# EAGLE schematic NeoPixel_HD_rev0 (EAGLE 7.2.0)
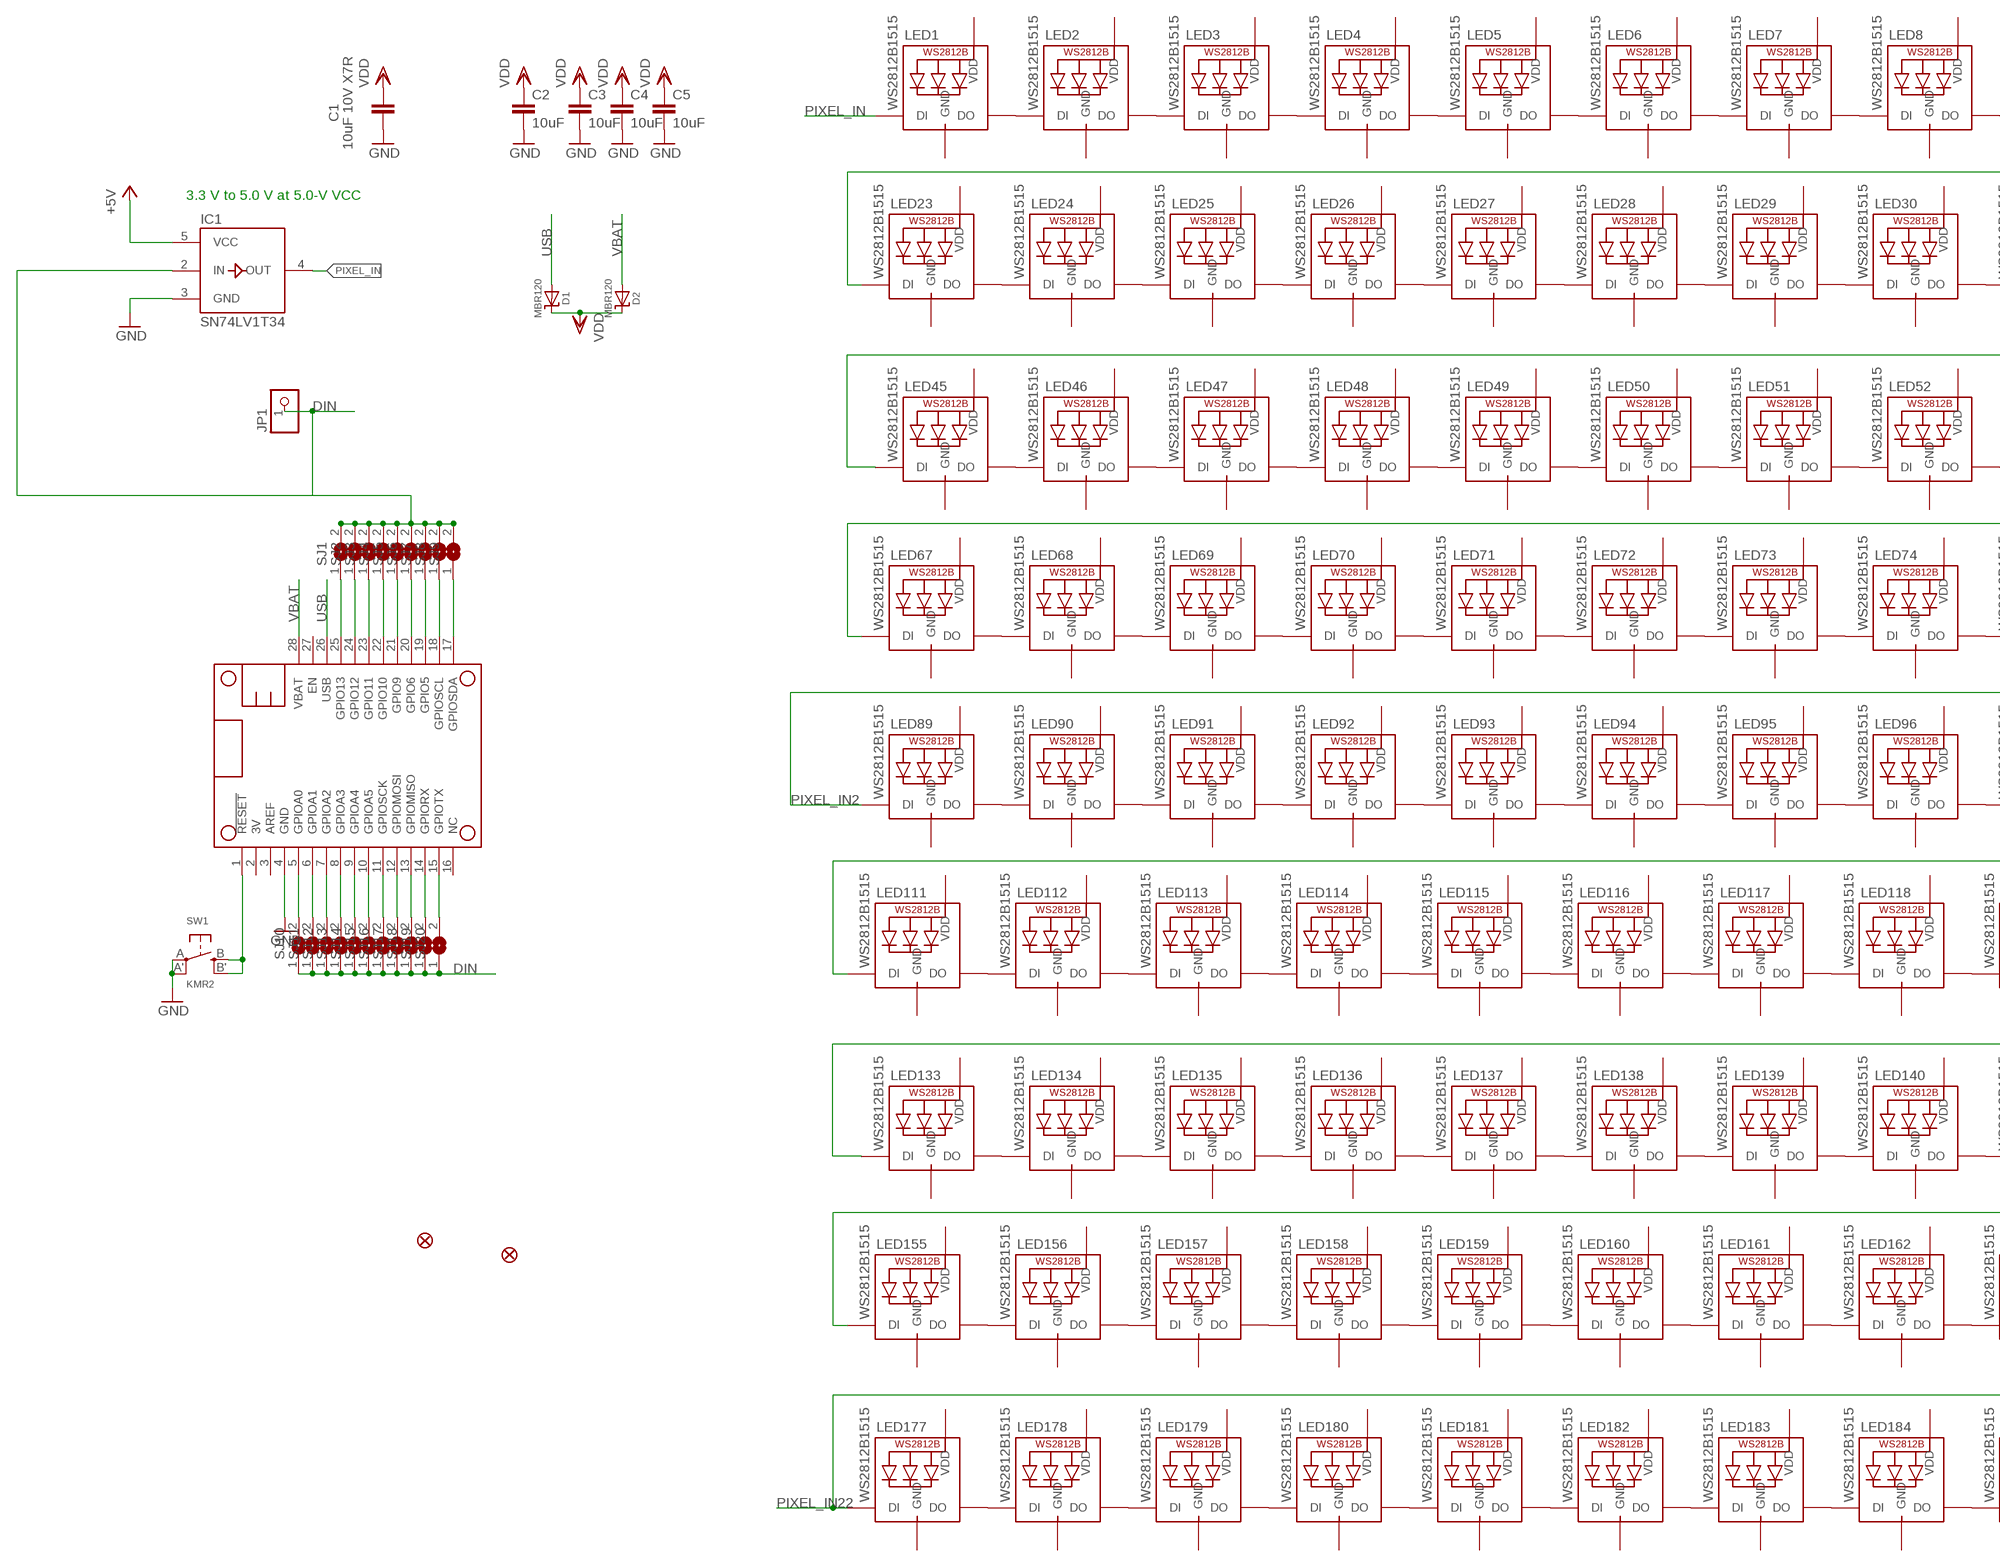
[diagram p0: schematic, sheet 1, part 1 of 2]
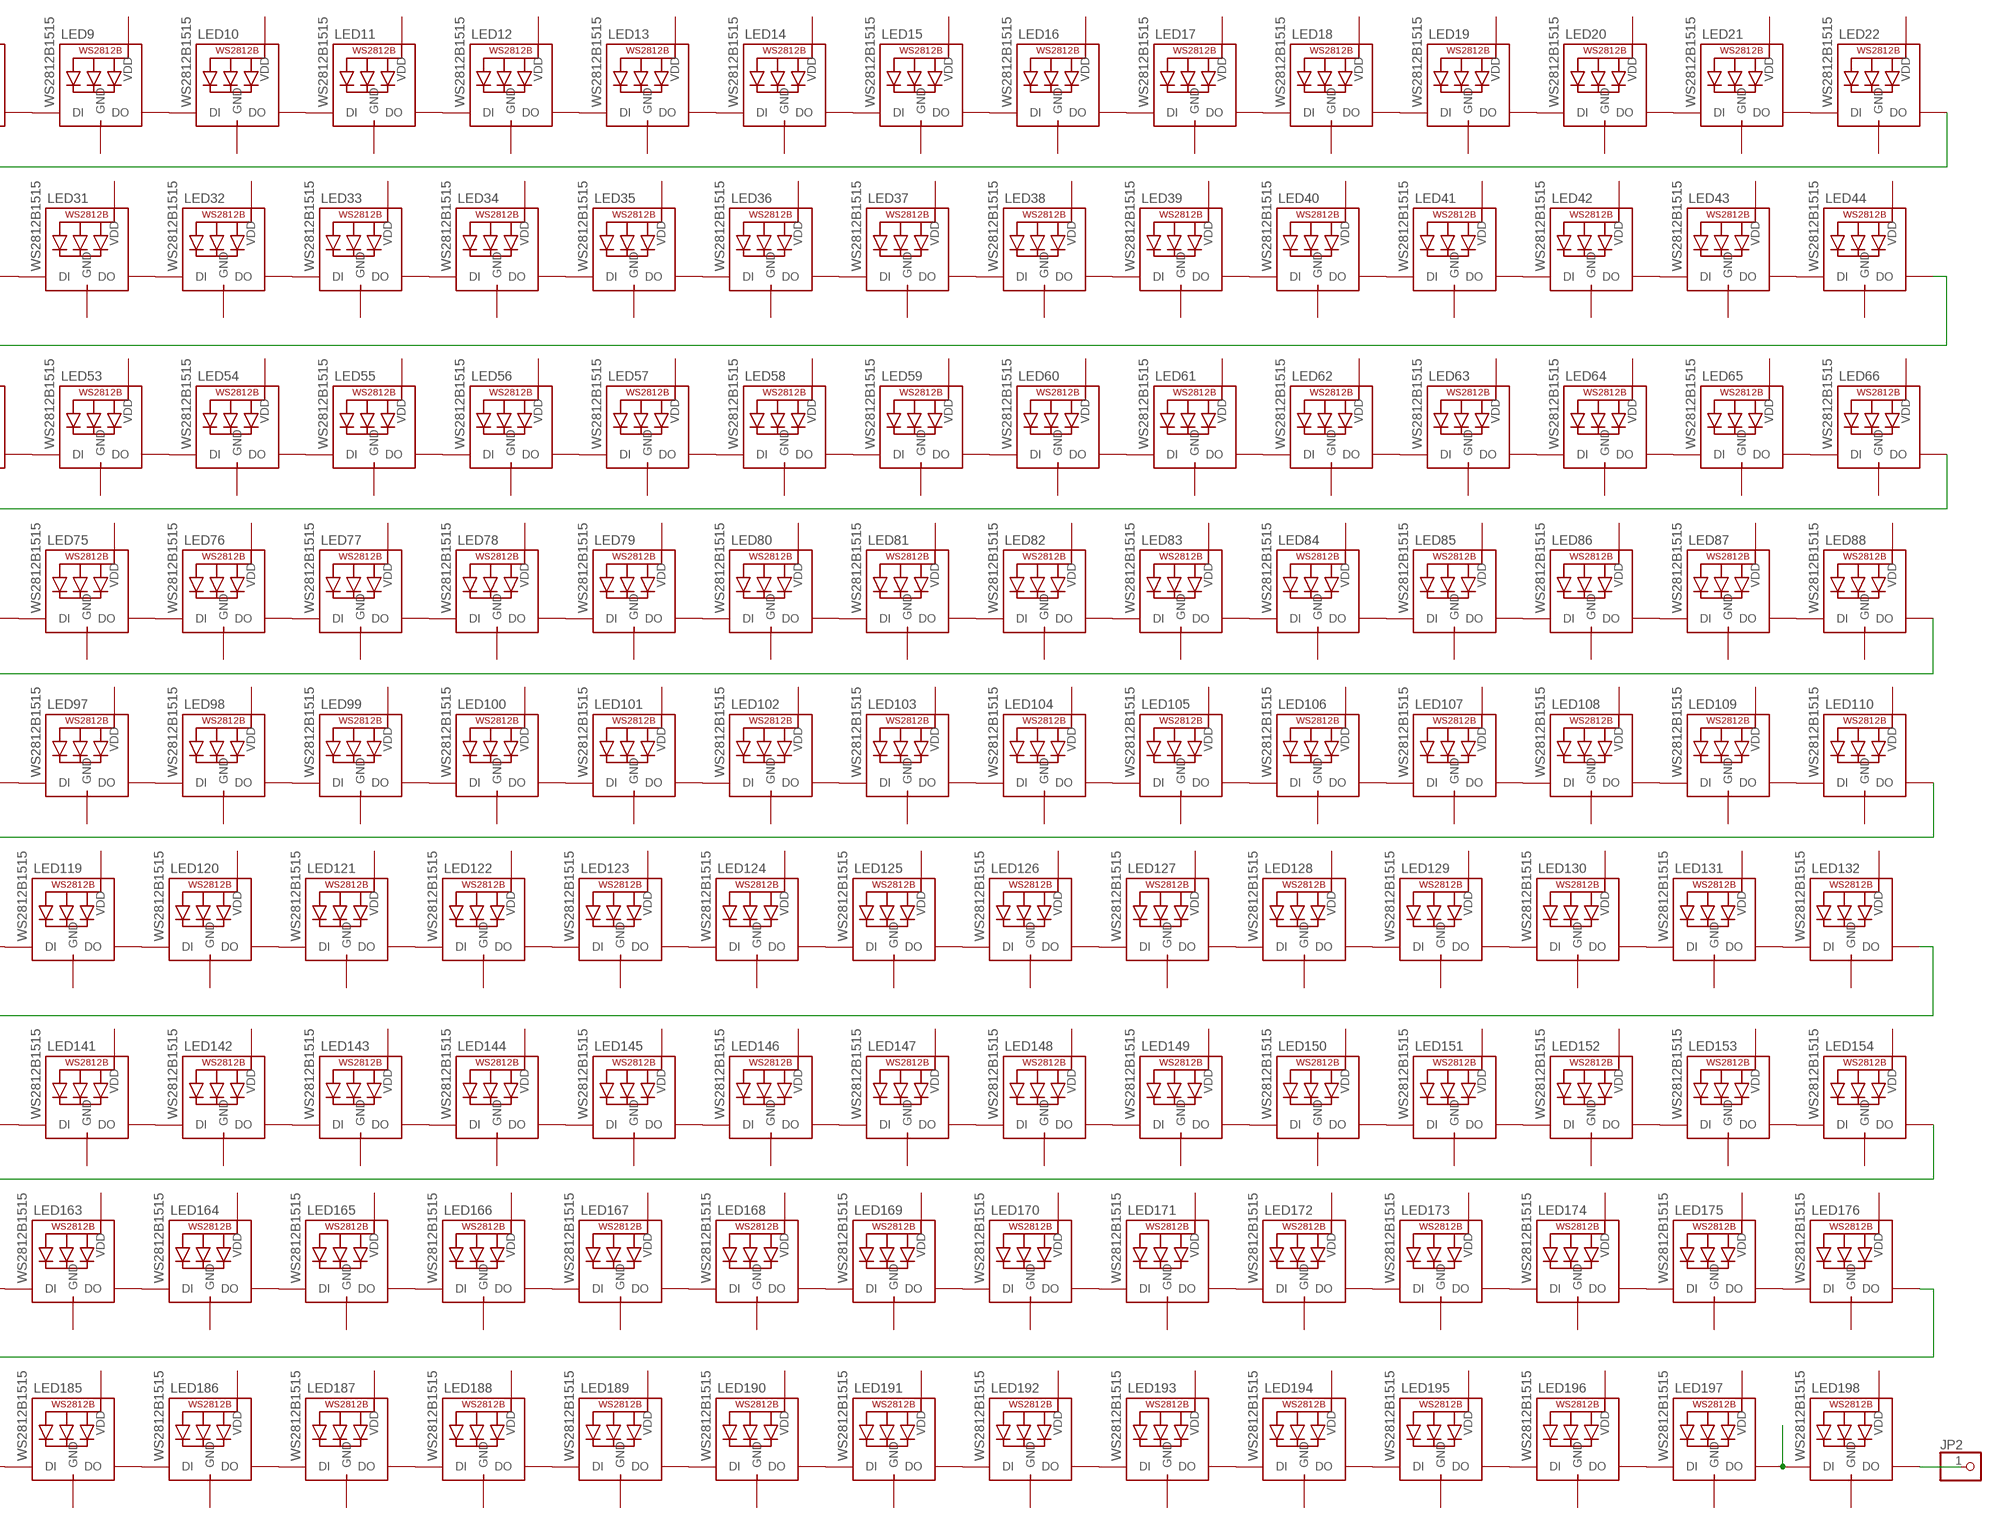
[diagram p1: schematic, sheet 1, part 2 of 2]

## Parts
C1  10uF 10V X7R  C-EUC0603-VISHAY  [C0603-VISHAY]
C2  10uF  C-EUC0603-VISHAY  [C0603-VISHAY]
C3  10uF  C-EUC0603-VISHAY  [C0603-VISHAY]
C4  10uF  C-EUC0603-VISHAY  [C0603-VISHAY]
C5  10uF  C-EUC0603-VISHAY  [C0603-VISHAY]
D1  MBR120  DIODE-SCHOTTKYSOD-123  [SOD-123]
D2  MBR120  DIODE-SCHOTTKYSOD-123  [SOD-123]
FID1  FIDUCIAL""  [FIDUCIAL_1MM]
FID2  FIDUCIAL""  [FIDUCIAL_1MM]
IC1  SN74LV1T34  [DCK_R-PDSO-G5]
JP1  HEADER-1X1ROUND  [1X01_ROUND]
JP2  HEADER-1X1ROUND  [1X01_ROUND]
LED1  WS2812B1515  [LED1515]
LED2  WS2812B1515  [LED1515]
LED3  WS2812B1515  [LED1515]
LED4  WS2812B1515  [LED1515]
LED5  WS2812B1515  [LED1515]
LED6  WS2812B1515  [LED1515]
LED7  WS2812B1515  [LED1515]
LED8  WS2812B1515  [LED1515]
LED9  WS2812B1515  [LED1515]
LED10  WS2812B1515  [LED1515]
LED11  WS2812B1515  [LED1515]
LED12  WS2812B1515  [LED1515]
LED13  WS2812B1515  [LED1515]
LED14  WS2812B1515  [LED1515]
LED15  WS2812B1515  [LED1515]
LED16  WS2812B1515  [LED1515]
LED17  WS2812B1515  [LED1515]
LED18  WS2812B1515  [LED1515]
LED19  WS2812B1515  [LED1515]
LED20  WS2812B1515  [LED1515]
LED21  WS2812B1515  [LED1515]
LED22  WS2812B1515  [LED1515]
LED23  WS2812B1515  [LED1515]
LED24  WS2812B1515  [LED1515]
LED25  WS2812B1515  [LED1515]
LED26  WS2812B1515  [LED1515]
LED27  WS2812B1515  [LED1515]
LED28  WS2812B1515  [LED1515]
LED29  WS2812B1515  [LED1515]
LED30  WS2812B1515  [LED1515]
LED31  WS2812B1515  [LED1515]
LED32  WS2812B1515  [LED1515]
LED33  WS2812B1515  [LED1515]
LED34  WS2812B1515  [LED1515]
LED35  WS2812B1515  [LED1515]
LED36  WS2812B1515  [LED1515]
LED37  WS2812B1515  [LED1515]
LED38  WS2812B1515  [LED1515]
LED39  WS2812B1515  [LED1515]
LED40  WS2812B1515  [LED1515]
LED41  WS2812B1515  [LED1515]
LED42  WS2812B1515  [LED1515]
LED43  WS2812B1515  [LED1515]
LED44  WS2812B1515  [LED1515]
LED45  WS2812B1515  [LED1515]
LED46  WS2812B1515  [LED1515]
LED47  WS2812B1515  [LED1515]
LED48  WS2812B1515  [LED1515]
LED49  WS2812B1515  [LED1515]
LED50  WS2812B1515  [LED1515]
LED51  WS2812B1515  [LED1515]
LED52  WS2812B1515  [LED1515]
LED53  WS2812B1515  [LED1515]
LED54  WS2812B1515  [LED1515]
LED55  WS2812B1515  [LED1515]
LED56  WS2812B1515  [LED1515]
LED57  WS2812B1515  [LED1515]
LED58  WS2812B1515  [LED1515]
LED59  WS2812B1515  [LED1515]
LED60  WS2812B1515  [LED1515]
LED61  WS2812B1515  [LED1515]
LED62  WS2812B1515  [LED1515]
LED63  WS2812B1515  [LED1515]
LED64  WS2812B1515  [LED1515]
LED65  WS2812B1515  [LED1515]
LED66  WS2812B1515  [LED1515]
LED67  WS2812B1515  [LED1515]
LED68  WS2812B1515  [LED1515]
LED69  WS2812B1515  [LED1515]
LED70  WS2812B1515  [LED1515]
LED71  WS2812B1515  [LED1515]
LED72  WS2812B1515  [LED1515]
LED73  WS2812B1515  [LED1515]
LED74  WS2812B1515  [LED1515]
LED75  WS2812B1515  [LED1515]
LED76  WS2812B1515  [LED1515]
LED77  WS2812B1515  [LED1515]
LED78  WS2812B1515  [LED1515]
LED79  WS2812B1515  [LED1515]
LED80  WS2812B1515  [LED1515]
LED81  WS2812B1515  [LED1515]
LED82  WS2812B1515  [LED1515]
LED83  WS2812B1515  [LED1515]
LED84  WS2812B1515  [LED1515]
LED85  WS2812B1515  [LED1515]
LED86  WS2812B1515  [LED1515]
LED87  WS2812B1515  [LED1515]
LED88  WS2812B1515  [LED1515]
LED89  WS2812B1515  [LED1515]
LED90  WS2812B1515  [LED1515]
LED91  WS2812B1515  [LED1515]
LED92  WS2812B1515  [LED1515]
LED93  WS2812B1515  [LED1515]
LED94  WS2812B1515  [LED1515]
LED95  WS2812B1515  [LED1515]
LED96  WS2812B1515  [LED1515]
LED97  WS2812B1515  [LED1515]
LED98  WS2812B1515  [LED1515]
LED99  WS2812B1515  [LED1515]
LED100  WS2812B1515  [LED1515]
LED101  WS2812B1515  [LED1515]
LED102  WS2812B1515  [LED1515]
LED103  WS2812B1515  [LED1515]
LED104  WS2812B1515  [LED1515]
LED105  WS2812B1515  [LED1515]
LED106  WS2812B1515  [LED1515]
LED107  WS2812B1515  [LED1515]
LED108  WS2812B1515  [LED1515]
LED109  WS2812B1515  [LED1515]
LED110  WS2812B1515  [LED1515]
LED111  WS2812B1515  [LED1515]
LED112  WS2812B1515  [LED1515]
LED113  WS2812B1515  [LED1515]
LED114  WS2812B1515  [LED1515]
LED115  WS2812B1515  [LED1515]
LED116  WS2812B1515  [LED1515]
LED117  WS2812B1515  [LED1515]
LED118  WS2812B1515  [LED1515]
LED119  WS2812B1515  [LED1515]
LED120  WS2812B1515  [LED1515]
LED121  WS2812B1515  [LED1515]
LED122  WS2812B1515  [LED1515]
LED123  WS2812B1515  [LED1515]
LED124  WS2812B1515  [LED1515]
LED125  WS2812B1515  [LED1515]
LED126  WS2812B1515  [LED1515]
LED127  WS2812B1515  [LED1515]
LED128  WS2812B1515  [LED1515]
LED129  WS2812B1515  [LED1515]
LED130  WS2812B1515  [LED1515]
LED131  WS2812B1515  [LED1515]
LED132  WS2812B1515  [LED1515]
LED133  WS2812B1515  [LED1515]
LED134  WS2812B1515  [LED1515]
LED135  WS2812B1515  [LED1515]
LED136  WS2812B1515  [LED1515]
LED137  WS2812B1515  [LED1515]
LED138  WS2812B1515  [LED1515]
LED139  WS2812B1515  [LED1515]
LED140  WS2812B1515  [LED1515]
LED141  WS2812B1515  [LED1515]
LED142  WS2812B1515  [LED1515]
LED143  WS2812B1515  [LED1515]
LED144  WS2812B1515  [LED1515]
LED145  WS2812B1515  [LED1515]
LED146  WS2812B1515  [LED1515]
LED147  WS2812B1515  [LED1515]
LED148  WS2812B1515  [LED1515]
LED149  WS2812B1515  [LED1515]
LED150  WS2812B1515  [LED1515]
LED151  WS2812B1515  [LED1515]
LED152  WS2812B1515  [LED1515]
LED153  WS2812B1515  [LED1515]
LED154  WS2812B1515  [LED1515]
LED155  WS2812B1515  [LED1515]
LED156  WS2812B1515  [LED1515]
LED157  WS2812B1515  [LED1515]
LED158  WS2812B1515  [LED1515]
LED159  WS2812B1515  [LED1515]
LED160  WS2812B1515  [LED1515]
LED161  WS2812B1515  [LED1515]
LED162  WS2812B1515  [LED1515]
LED163  WS2812B1515  [LED1515]
LED164  WS2812B1515  [LED1515]
LED165  WS2812B1515  [LED1515]
LED166  WS2812B1515  [LED1515]
LED167  WS2812B1515  [LED1515]
LED168  WS2812B1515  [LED1515]
LED169  WS2812B1515  [LED1515]
LED170  WS2812B1515  [LED1515]
LED171  WS2812B1515  [LED1515]
LED172  WS2812B1515  [LED1515]
LED173  WS2812B1515  [LED1515]
LED174  WS2812B1515  [LED1515]
LED175  WS2812B1515  [LED1515]
LED176  WS2812B1515  [LED1515]
LED177  WS2812B1515  [LED1515]
LED178  WS2812B1515  [LED1515]
LED179  WS2812B1515  [LED1515]
LED180  WS2812B1515  [LED1515]
LED181  WS2812B1515  [LED1515]
LED182  WS2812B1515  [LED1515]
LED183  WS2812B1515  [LED1515]
LED184  WS2812B1515  [LED1515]
LED185  WS2812B1515  [LED1515]
LED186  WS2812B1515  [LED1515]
LED187  WS2812B1515  [LED1515]
LED188  WS2812B1515  [LED1515]
LED189  WS2812B1515  [LED1515]
LED190  WS2812B1515  [LED1515]
LED191  WS2812B1515  [LED1515]
LED192  WS2812B1515  [LED1515]
LED193  WS2812B1515  [LED1515]
LED194  WS2812B1515  [LED1515]
LED195  WS2812B1515  [LED1515]
LED196  WS2812B1515  [LED1515]
LED197  WS2812B1515  [LED1515]
LED198  WS2812B1515  [LED1515]
MS1  FEATHERWING  [FEATHERWING]
SJ1  SOLDERJUMPER  [SOLDERJUMPER_ARROW_NOPASTE]
SJ2  SOLDERJUMPER  [SOLDERJUMPER_ARROW_NOPASTE]
SJ3  SOLDERJUMPER  [SOLDERJUMPER_ARROW_NOPASTE]
SJ4  SOLDERJUMPER  [SOLDERJUMPER_ARROW_NOPASTE]
SJ5  SOLDERJUMPER  [SOLDERJUMPER_ARROW_NOPASTE]
SJ6  SOLDERJUMPERCLOSED  [SOLDERJUMPER_CLOSEDWIRE]
SJ7  SOLDERJUMPER  [SOLDERJUMPER_ARROW_NOPASTE]
SJ8  SOLDERJUMPER  [SOLDERJUMPER_ARROW_NOPASTE]
SJ9  SOLDERJUMPER  [SOLDERJUMPER_ARROW_NOPASTE]
SJ10  SOLDERJUMPER  [SOLDERJUMPER_ARROW_NOPASTE]
SJ11  SOLDERJUMPER  [SOLDERJUMPER_ARROW_NOPASTE]
SJ12  SOLDERJUMPER  [SOLDERJUMPER_ARROW_NOPASTE]
SJ13  SOLDERJUMPER  [SOLDERJUMPER_ARROW_NOPASTE]
SJ14  SOLDERJUMPER  [SOLDERJUMPER_ARROW_NOPASTE]
SJ15  SOLDERJUMPER  [SOLDERJUMPER_ARROW_NOPASTE]
SJ16  SOLDERJUMPER  [SOLDERJUMPER_ARROW_NOPASTE]
SJ17  SOLDERJUMPER  [SOLDERJUMPER_ARROW_NOPASTE]
SJ18  SOLDERJUMPER  [SOLDERJUMPER_ARROW_NOPASTE]
SJ19  SOLDERJUMPER  [SOLDERJUMPER_ARROW_NOPASTE]
SJ20  SOLDERJUMPER  [SOLDERJUMPER_ARROW_NOPASTE]
SW1  KMR2  SWITCH_TACT_SMT4.6X2.8  [BTN_KMR2_4.6X2.8]

## Nets
D6: MS1.20(GPIO6) SJ6.1
DIN: IC1.2(IN) JP1.1 SJ1.2 SJ2.2 SJ3.2 SJ4.2 SJ5.2 SJ6.2 SJ7.2 SJ8.2 SJ9.2 SJ10.1 SJ11.1 SJ12.1 SJ13.1 SJ14.1 SJ15.1 SJ16.1 SJ17.1 SJ18.1 SJ19.1 SJ20.1
GND: C1.2 C2.2 C3.2 C4.2 C5.2 IC1.3(GND) MS1.4(GND) SW1.A'(P1) SW1.A(P)
N$1: LED42.DOUT(DO) LED43.DIN(DI)
N$2: LED43.DOUT(DO) LED44.DIN(DI)
N$3: MS1.25(GPIO13) SJ1.1
N$4: MS1.15(GPIOTX) SJ20.2
N$5: MS1.24(GPIO12) SJ2.1
N$6: MS1.14(GPIORX) SJ19.2
N$7: MS1.13(GPIOMISO) SJ18.2
N$8: MS1.12(GPIOMOSI) SJ17.2
N$9: MS1.11(GPIOSCK) SJ16.2
N$10: MS1.10(GPIOA5) SJ15.2
N$11: MS1.9(GPIOA4) SJ14.2
N$12: MS1.8(GPIOA3) SJ13.2
N$13: MS1.7(GPIOA2) SJ12.2
N$14: MS1.6(GPIOA1) SJ11.2
N$15: MS1.5(GPIOA0) SJ10.2
N$16: LED14.DOUT(DO) LED15.DIN(DI)
N$17: LED45.DOUT(DO) LED46.DIN(DI)
N$18: MS1.1(!RESET) SW1.B'(S1) SW1.B(S)
N$19: MS1.23(GPIO11) SJ3.1
N$20: MS1.22(GPIO10) SJ4.1
N$21: MS1.21(GPIO9) SJ5.1
N$22: JP2.1 LED198.DOUT(DO)
N$23: MS1.19(GPIO5) SJ7.1
N$24: MS1.18(GPIOSCL) SJ8.1
N$25: MS1.17(GPIOSDA) SJ9.1
N$26: LED46.DOUT(DO) LED47.DIN(DI)
N$27: LED47.DOUT(DO) LED48.DIN(DI)
N$28: LED48.DOUT(DO) LED49.DIN(DI)
N$29: LED49.DOUT(DO) LED50.DIN(DI)
N$30: LED50.DOUT(DO) LED51.DIN(DI)
N$31: LED51.DOUT(DO) LED52.DIN(DI)
N$32: LED52.DOUT(DO) LED53.DIN(DI)
N$33: LED54.DOUT(DO) LED55.DIN(DI)
N$34: LED53.DOUT(DO) LED54.DIN(DI)
N$35: LED55.DOUT(DO) LED56.DIN(DI)
N$36: LED56.DOUT(DO) LED57.DIN(DI)
N$37: LED59.DOUT(DO) LED60.DIN(DI)
N$38: LED60.DOUT(DO) LED61.DIN(DI)
N$39: LED61.DOUT(DO) LED62.DIN(DI)
N$40: LED62.DOUT(DO) LED63.DIN(DI)
N$41: LED63.DOUT(DO) LED64.DIN(DI)
N$42: LED64.DOUT(DO) LED65.DIN(DI)
N$43: LED65.DOUT(DO) LED66.DIN(DI)
N$44: LED66.DOUT(DO) LED67.DIN(DI)
N$45: LED68.DOUT(DO) LED69.DIN(DI)
N$46: LED67.DOUT(DO) LED68.DIN(DI)
N$47: LED69.DOUT(DO) LED70.DIN(DI)
N$48: LED70.DOUT(DO) LED71.DIN(DI)
N$49: LED73.DOUT(DO) LED74.DIN(DI)
N$50: LED74.DOUT(DO) LED75.DIN(DI)
N$51: LED75.DOUT(DO) LED76.DIN(DI)
N$52: LED76.DOUT(DO) LED77.DIN(DI)
N$53: LED77.DOUT(DO) LED78.DIN(DI)
N$54: LED1.DOUT(DO) LED2.DIN(DI)
N$55: LED2.DOUT(DO) LED3.DIN(DI)
N$56: LED3.DOUT(DO) LED4.DIN(DI)
N$57: LED4.DOUT(DO) LED5.DIN(DI)
N$58: LED5.DOUT(DO) LED6.DIN(DI)
N$59: LED6.DOUT(DO) LED7.DIN(DI)
N$60: LED7.DOUT(DO) LED8.DIN(DI)
N$61: LED8.DOUT(DO) LED9.DIN(DI)
N$62: LED10.DOUT(DO) LED11.DIN(DI)
N$63: LED9.DOUT(DO) LED10.DIN(DI)
N$64: LED11.DOUT(DO) LED12.DIN(DI)
N$65: LED12.DOUT(DO) LED13.DIN(DI)
N$66: LED15.DOUT(DO) LED16.DIN(DI)
N$67: LED16.DOUT(DO) LED17.DIN(DI)
N$68: LED17.DOUT(DO) LED18.DIN(DI)
N$69: LED18.DOUT(DO) LED19.DIN(DI)
N$71: LED19.DOUT(DO) LED20.DIN(DI)
N$72: LED20.DOUT(DO) LED21.DIN(DI)
N$73: LED21.DOUT(DO) LED22.DIN(DI)
N$74: LED22.DOUT(DO) LED23.DIN(DI)
N$75: LED24.DOUT(DO) LED25.DIN(DI)
N$76: LED23.DOUT(DO) LED24.DIN(DI)
N$77: LED25.DOUT(DO) LED26.DIN(DI)
N$78: LED26.DOUT(DO) LED27.DIN(DI)
N$79: LED29.DOUT(DO) LED30.DIN(DI)
N$80: LED30.DOUT(DO) LED31.DIN(DI)
N$81: LED31.DOUT(DO) LED32.DIN(DI)
N$82: LED32.DOUT(DO) LED33.DIN(DI)
N$83: LED33.DOUT(DO) LED34.DIN(DI)
N$84: LED34.DOUT(DO) LED35.DIN(DI)
N$85: LED35.DOUT(DO) LED36.DIN(DI)
N$86: LED36.DOUT(DO) LED37.DIN(DI)
N$87: LED38.DOUT(DO) LED39.DIN(DI)
N$88: LED37.DOUT(DO) LED38.DIN(DI)
N$89: LED39.DOUT(DO) LED40.DIN(DI)
N$90: LED40.DOUT(DO) LED41.DIN(DI)
N$91: LED13.DOUT(DO) LED14.DIN(DI)
N$92: LED27.DOUT(DO) LED28.DIN(DI)
N$93: LED41.DOUT(DO) LED42.DIN(DI)
N$94: LED78.DOUT(DO) LED79.DIN(DI)
N$95: LED28.DOUT(DO) LED29.DIN(DI)
N$96: LED79.DOUT(DO) LED80.DIN(DI)
N$97: LED80.DOUT(DO) LED81.DIN(DI)
N$98: LED82.DOUT(DO) LED83.DIN(DI)
N$99: LED81.DOUT(DO) LED82.DIN(DI)
N$100: LED83.DOUT(DO) LED84.DIN(DI)
N$101: LED84.DOUT(DO) LED85.DIN(DI)
N$102: LED57.DOUT(DO) LED58.DIN(DI)
N$103: LED71.DOUT(DO) LED72.DIN(DI)
N$104: LED85.DOUT(DO) LED86.DIN(DI)
N$105: LED72.DOUT(DO) LED73.DIN(DI)
N$106: LED86.DOUT(DO) LED87.DIN(DI)
N$107: LED87.DOUT(DO) LED88.DIN(DI)
N$108: LED58.DOUT(DO) LED59.DIN(DI)
N$109: LED89.DOUT(DO) LED90.DIN(DI)
N$110: LED90.DOUT(DO) LED91.DIN(DI)
N$111: LED91.DOUT(DO) LED92.DIN(DI)
N$112: LED92.DOUT(DO) LED93.DIN(DI)
N$113: LED93.DOUT(DO) LED94.DIN(DI)
N$114: LED94.DOUT(DO) LED95.DIN(DI)
N$115: LED95.DOUT(DO) LED96.DIN(DI)
N$116: LED96.DOUT(DO) LED97.DIN(DI)
N$117: LED98.DOUT(DO) LED99.DIN(DI)
N$118: LED97.DOUT(DO) LED98.DIN(DI)
N$119: LED99.DOUT(DO) LED100.DIN(DI)
N$120: LED100.DOUT(DO) LED101.DIN(DI)
N$121: LED103.DOUT(DO) LED104.DIN(DI)
N$122: LED104.DOUT(DO) LED105.DIN(DI)
N$123: LED105.DOUT(DO) LED106.DIN(DI)
N$124: LED106.DOUT(DO) LED107.DIN(DI)
N$125: LED107.DOUT(DO) LED108.DIN(DI)
N$126: LED108.DOUT(DO) LED109.DIN(DI)
N$127: LED109.DOUT(DO) LED110.DIN(DI)
N$128: LED110.DOUT(DO) LED111.DIN(DI)
N$129: LED112.DOUT(DO) LED113.DIN(DI)
N$130: LED111.DOUT(DO) LED112.DIN(DI)
N$131: LED113.DOUT(DO) LED114.DIN(DI)
N$132: LED114.DOUT(DO) LED115.DIN(DI)
N$133: LED117.DOUT(DO) LED118.DIN(DI)
N$134: LED118.DOUT(DO) LED119.DIN(DI)
N$135: LED119.DOUT(DO) LED120.DIN(DI)
N$136: LED120.DOUT(DO) LED121.DIN(DI)
N$137: LED121.DOUT(DO) LED122.DIN(DI)
N$138: LED122.DOUT(DO) LED123.DIN(DI)
N$139: LED123.DOUT(DO) LED124.DIN(DI)
N$140: LED124.DOUT(DO) LED125.DIN(DI)
N$141: LED126.DOUT(DO) LED127.DIN(DI)
N$142: LED125.DOUT(DO) LED126.DIN(DI)
N$143: LED127.DOUT(DO) LED128.DIN(DI)
N$144: LED128.DOUT(DO) LED129.DIN(DI)
N$145: LED101.DOUT(DO) LED102.DIN(DI)
N$146: LED115.DOUT(DO) LED116.DIN(DI)
N$147: LED129.DOUT(DO) LED130.DIN(DI)
N$148: LED116.DOUT(DO) LED117.DIN(DI)
N$149: LED130.DOUT(DO) LED131.DIN(DI)
N$150: LED131.DOUT(DO) LED132.DIN(DI)
N$151: LED102.DOUT(DO) LED103.DIN(DI)
N$152: LED133.DOUT(DO) LED134.DIN(DI)
N$153: LED134.DOUT(DO) LED135.DIN(DI)
N$154: LED135.DOUT(DO) LED136.DIN(DI)
N$155: LED136.DOUT(DO) LED137.DIN(DI)
N$156: LED137.DOUT(DO) LED138.DIN(DI)
N$157: LED138.DOUT(DO) LED139.DIN(DI)
N$158: LED139.DOUT(DO) LED140.DIN(DI)
N$159: LED140.DOUT(DO) LED141.DIN(DI)
N$160: LED142.DOUT(DO) LED143.DIN(DI)
N$161: LED141.DOUT(DO) LED142.DIN(DI)
N$162: LED143.DOUT(DO) LED144.DIN(DI)
N$163: LED144.DOUT(DO) LED145.DIN(DI)
N$164: LED147.DOUT(DO) LED148.DIN(DI)
N$165: LED148.DOUT(DO) LED149.DIN(DI)
N$166: LED149.DOUT(DO) LED150.DIN(DI)
N$167: LED150.DOUT(DO) LED151.DIN(DI)
N$168: LED151.DOUT(DO) LED152.DIN(DI)
N$169: LED152.DOUT(DO) LED153.DIN(DI)
N$170: LED153.DOUT(DO) LED154.DIN(DI)
N$171: LED154.DOUT(DO) LED155.DIN(DI)
N$172: LED156.DOUT(DO) LED157.DIN(DI)
N$173: LED155.DOUT(DO) LED156.DIN(DI)
N$174: LED157.DOUT(DO) LED158.DIN(DI)
N$175: LED158.DOUT(DO) LED159.DIN(DI)
N$176: LED161.DOUT(DO) LED162.DIN(DI)
N$177: LED162.DOUT(DO) LED163.DIN(DI)
N$178: LED163.DOUT(DO) LED164.DIN(DI)
N$179: LED164.DOUT(DO) LED165.DIN(DI)
N$180: LED165.DOUT(DO) LED166.DIN(DI)
N$181: LED166.DOUT(DO) LED167.DIN(DI)
N$182: LED167.DOUT(DO) LED168.DIN(DI)
N$183: LED168.DOUT(DO) LED169.DIN(DI)
N$184: LED170.DOUT(DO) LED171.DIN(DI)
N$185: LED169.DOUT(DO) LED170.DIN(DI)
N$186: LED171.DOUT(DO) LED172.DIN(DI)
N$187: LED172.DOUT(DO) LED173.DIN(DI)
N$188: LED145.DOUT(DO) LED146.DIN(DI)
N$189: LED159.DOUT(DO) LED160.DIN(DI)
N$190: LED173.DOUT(DO) LED174.DIN(DI)
N$191: LED160.DOUT(DO) LED161.DIN(DI)
N$192: LED174.DOUT(DO) LED175.DIN(DI)
N$193: LED175.DOUT(DO) LED176.DIN(DI)
N$194: LED146.DOUT(DO) LED147.DIN(DI)
N$195: LED177.DOUT(DO) LED178.DIN(DI)
N$196: LED178.DOUT(DO) LED179.DIN(DI)
N$197: LED179.DOUT(DO) LED180.DIN(DI)
N$198: LED180.DOUT(DO) LED181.DIN(DI)
N$199: LED181.DOUT(DO) LED182.DIN(DI)
N$200: LED182.DOUT(DO) LED183.DIN(DI)
N$201: LED183.DOUT(DO) LED184.DIN(DI)
N$202: LED184.DOUT(DO) LED185.DIN(DI)
N$203: LED186.DOUT(DO) LED187.DIN(DI)
N$204: LED185.DOUT(DO) LED186.DIN(DI)
N$205: LED187.DOUT(DO) LED188.DIN(DI)
N$206: LED188.DOUT(DO) LED189.DIN(DI)
N$207: LED191.DOUT(DO) LED192.DIN(DI)
N$208: LED192.DOUT(DO) LED193.DIN(DI)
N$209: LED193.DOUT(DO) LED194.DIN(DI)
N$210: LED194.DOUT(DO) LED195.DIN(DI)
N$211: LED195.DOUT(DO) LED196.DIN(DI)
N$212: LED196.DOUT(DO) LED197.DIN(DI)
N$213: LED197.DOUT(DO) LED198.DIN(DI)
N$215: LED190.DOUT(DO) LED191.DIN(DI)
N$216: LED189.DOUT(DO) LED190.DIN(DI)
PIXEL_IN: IC1.4(OUT) LED1.DIN(DI)
PIXEL_IN1: LED44.DOUT(DO) LED45.DIN(DI)
PIXEL_IN2: LED88.DOUT(DO) LED89.DIN(DI)
PIXEL_IN11: LED132.DOUT(DO) LED133.DIN(DI)
PIXEL_IN22: LED176.DOUT(DO) LED177.DIN(DI)
USB: D1.A MS1.26(USB)
VBAT: D2.A MS1.28(VBAT)
VDD: C1.1 C2.1 C3.1 C4.1 C5.1 D1.C D2.C IC1.5(VCC) ; supply symbol labelled +5V
Unconnected: MS1.2(3V) MS1.3(AREF) MS1.16(NC) MS1.27(EN)

## Notes on the sheet
- 3.3 V to 5.0 V at 5.0-V VCC

## Power pins joined to a net without a drawn wire
GND: LED1.GND LED2.GND LED3.GND LED4.GND LED5.GND LED6.GND LED7.GND LED8.GND LED9.GND LED10.GND LED11.GND LED12.GND LED13.GND LED14.GND LED15.GND LED16.GND LED17.GND LED18.GND LED19.GND LED20.GND LED21.GND LED22.GND LED23.GND LED24.GND LED25.GND LED26.GND LED27.GND LED28.GND LED29.GND LED30.GND LED31.GND LED32.GND LED33.GND LED34.GND LED35.GND LED36.GND LED37.GND LED38.GND LED39.GND LED40.GND LED41.GND LED42.GND LED43.GND LED44.GND LED45.GND LED46.GND LED47.GND LED48.GND LED49.GND LED50.GND LED51.GND LED52.GND LED53.GND LED54.GND LED55.GND LED56.GND LED57.GND LED58.GND LED59.GND LED60.GND LED61.GND LED62.GND LED63.GND LED64.GND LED65.GND LED66.GND LED67.GND LED68.GND LED69.GND LED70.GND LED71.GND LED72.GND LED73.GND LED74.GND LED75.GND LED76.GND LED77.GND LED78.GND LED79.GND LED80.GND LED81.GND LED82.GND LED83.GND LED84.GND LED85.GND LED86.GND LED87.GND LED88.GND LED89.GND LED90.GND LED91.GND LED92.GND LED93.GND LED94.GND LED95.GND LED96.GND LED97.GND LED98.GND LED99.GND LED100.GND LED101.GND LED102.GND LED103.GND LED104.GND LED105.GND LED106.GND LED107.GND LED108.GND LED109.GND LED110.GND LED111.GND LED112.GND LED113.GND LED114.GND LED115.GND LED116.GND LED117.GND LED118.GND LED119.GND LED120.GND LED121.GND LED122.GND LED123.GND LED124.GND LED125.GND LED126.GND LED127.GND LED128.GND LED129.GND LED130.GND LED131.GND LED132.GND LED133.GND LED134.GND LED135.GND LED136.GND LED137.GND LED138.GND LED139.GND LED140.GND LED141.GND LED142.GND LED143.GND LED144.GND LED145.GND LED146.GND LED147.GND LED148.GND LED149.GND LED150.GND LED151.GND LED152.GND LED153.GND LED154.GND LED155.GND LED156.GND LED157.GND LED158.GND LED159.GND LED160.GND LED161.GND LED162.GND LED163.GND LED164.GND LED165.GND LED166.GND LED167.GND LED168.GND LED169.GND LED170.GND LED171.GND LED172.GND LED173.GND LED174.GND LED175.GND LED176.GND LED177.GND LED178.GND LED179.GND LED180.GND LED181.GND LED182.GND LED183.GND LED184.GND LED185.GND LED186.GND LED187.GND LED188.GND LED189.GND LED190.GND LED191.GND LED192.GND LED193.GND LED194.GND LED195.GND LED196.GND LED197.GND LED198.GND
VDD: LED1.VDD LED2.VDD LED3.VDD LED4.VDD LED5.VDD LED6.VDD LED7.VDD LED8.VDD LED9.VDD LED10.VDD LED11.VDD LED12.VDD LED13.VDD LED14.VDD LED15.VDD LED16.VDD LED17.VDD LED18.VDD LED19.VDD LED20.VDD LED21.VDD LED22.VDD LED23.VDD LED24.VDD LED25.VDD LED26.VDD LED27.VDD LED28.VDD LED29.VDD LED30.VDD LED31.VDD LED32.VDD LED33.VDD LED34.VDD LED35.VDD LED36.VDD LED37.VDD LED38.VDD LED39.VDD LED40.VDD LED41.VDD LED42.VDD LED43.VDD LED44.VDD LED45.VDD LED46.VDD LED47.VDD LED48.VDD LED49.VDD LED50.VDD LED51.VDD LED52.VDD LED53.VDD LED54.VDD LED55.VDD LED56.VDD LED57.VDD LED58.VDD LED59.VDD LED60.VDD LED61.VDD LED62.VDD LED63.VDD LED64.VDD LED65.VDD LED66.VDD LED67.VDD LED68.VDD LED69.VDD LED70.VDD LED71.VDD LED72.VDD LED73.VDD LED74.VDD LED75.VDD LED76.VDD LED77.VDD LED78.VDD LED79.VDD LED80.VDD LED81.VDD LED82.VDD LED83.VDD LED84.VDD LED85.VDD LED86.VDD LED87.VDD LED88.VDD LED89.VDD LED90.VDD LED91.VDD LED92.VDD LED93.VDD LED94.VDD LED95.VDD LED96.VDD LED97.VDD LED98.VDD LED99.VDD LED100.VDD LED101.VDD LED102.VDD LED103.VDD LED104.VDD LED105.VDD LED106.VDD LED107.VDD LED108.VDD LED109.VDD LED110.VDD LED111.VDD LED112.VDD LED113.VDD LED114.VDD LED115.VDD LED116.VDD LED117.VDD LED118.VDD LED119.VDD LED120.VDD LED121.VDD LED122.VDD LED123.VDD LED124.VDD LED125.VDD LED126.VDD LED127.VDD LED128.VDD LED129.VDD LED130.VDD LED131.VDD LED132.VDD LED133.VDD LED134.VDD LED135.VDD LED136.VDD LED137.VDD LED138.VDD LED139.VDD LED140.VDD LED141.VDD LED142.VDD LED143.VDD LED144.VDD LED145.VDD LED146.VDD LED147.VDD LED148.VDD LED149.VDD LED150.VDD LED151.VDD LED152.VDD LED153.VDD LED154.VDD LED155.VDD LED156.VDD LED157.VDD LED158.VDD LED159.VDD LED160.VDD LED161.VDD LED162.VDD LED163.VDD LED164.VDD LED165.VDD LED166.VDD LED167.VDD LED168.VDD LED169.VDD LED170.VDD LED171.VDD LED172.VDD LED173.VDD LED174.VDD LED175.VDD LED176.VDD LED177.VDD LED178.VDD LED179.VDD LED180.VDD LED181.VDD LED182.VDD LED183.VDD LED184.VDD LED185.VDD LED186.VDD LED187.VDD LED188.VDD LED189.VDD LED190.VDD LED191.VDD LED192.VDD LED193.VDD LED194.VDD LED195.VDD LED196.VDD LED197.VDD LED198.VDD

## Library data of the parts
C1-C5 = rcl:C-EU: CAPACITOR, European symbol
D1 D2 = microbuilder:DIODE-SCHOTTKY
FID1 FID2 = microbuilder:FIDUCIAL: Fiducial Alignment Points Various fiducial points for machine vision alignment.; BOM: EXCLUDE
IC1 = texas:SN74LV1T34
JP1 JP2 = microbuilder:HEADER-1X1: PIN HEADER
LED1-LED198 = adafruit:WS2812B
MS1 = microbuilder:FEATHERWING
SJ1-SJ5 SJ7-SJ20 = microbuilder:SOLDERJUMPER: SMD Solder JUMPER Solder the two pads together to create a connection, or remove the solder to break it. REFLOW - Use this footprint for solder paste and reflow ovens. WAVE - Use this footprint for hand-soldering (larger pads). CLOSED - Has a trace between the two pads to ensure it is closed by default. The trace needs to be cut to disable the jumper, and can be closed again by creating a solder bridge between the two pads.; BOM: EXCLUDE
SJ6 = microbuilder:SOLDERJUMPER: SMD Solder JUMPER Solder the two pads together to create a connection, or remove the solder to break it. REFLOW - Use this footprint for solder paste and reflow ovens. WAVE - Use this footprint for hand-soldering (larger pads). CLOSED - Has a trace between the two pads to ensure it is closed by default. The trace needs to be cut to disable the jumper, and can be closed again by creating a solder bridge between the two pads.
SW1 = microbuilder:SWITCH_TACT_SMT: SMT Tact Switches 6x6mm - Digikey: P12940SCT-ND KMR2 (4.6x2.8mm) - Digikey: 401-1426-1-ND EVQ-PQHB55 - Light Touch, 160GF (4.5x4.5mm) - Digikey: P8090SCT-ND KMT0 - KMT021 NGJ LHS (etc.) IP68/Waterproof - Digikey: CKN10289CT-ND